# EAGLE schematic PL9823-breakout-board (EAGLE 6.5.0)
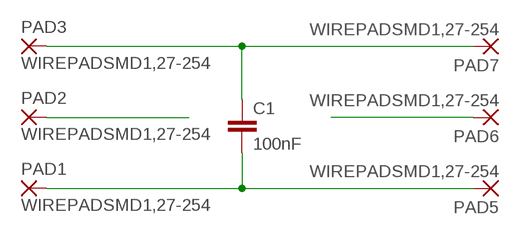
[diagram p0: schematic, sheet 1]

## Parts
C1  100nF  C-EUC0805K  [C0805K]
PAD1  WIREPADSMD1,27-254  [SMD1,27-2,54]
PAD2  WIREPADSMD1,27-254  [SMD1,27-2,54]
PAD3  WIREPADSMD1,27-254  [SMD1,27-2,54]
PAD5  WIREPADSMD1,27-254  [SMD1,27-2,54]
PAD6  WIREPADSMD1,27-254  [SMD1,27-2,54]
PAD7  WIREPADSMD1,27-254  [SMD1,27-2,54]

## Nets
+: C1.1 PAD3.1(P) PAD7.1(P)
-: C1.2 PAD1.1(P) PAD5.1(P)
DI: PAD2.1(P)
DO: PAD6.1(P)

## Library data of the parts
C1 = rcl:C-EU: CAPACITOR, European symbol
PAD1-PAD3 PAD5-PAD7 = wirepad:WIREPAD: Wire PAD connect wire on PCB

## Net classes
0 default: clearance 0.205 mm